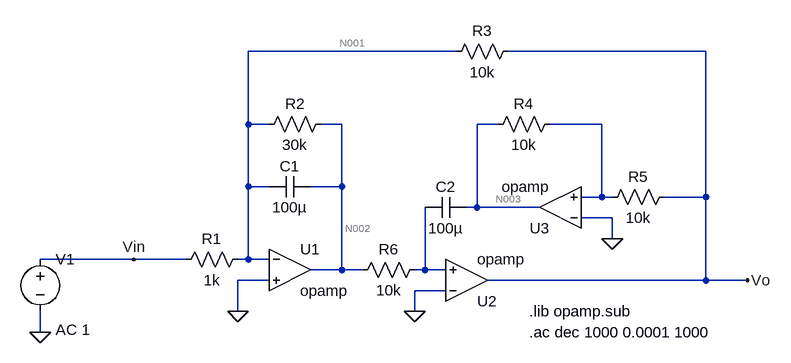
[diagram p0: schematic simulacion.asc]
simulacion.asc, the LTspice schematic file:
Version 4
SHEET 1 880 680
WIRE 288 -112 -32 -112
WIRE 672 -112 368 -112
WIRE -32 0 -32 -112
WIRE 0 0 -32 0
WIRE 112 0 80 0
WIRE 352 0 320 0
WIRE 512 0 432 0
WIRE -32 96 -32 0
WIRE 0 96 -32 96
WIRE 112 96 112 0
WIRE 112 96 64 96
WIRE 512 112 512 0
WIRE 512 112 480 112
WIRE 528 112 512 112
WIRE 672 112 672 -112
WIRE 672 112 608 112
WIRE 320 128 320 0
WIRE 320 128 304 128
WIRE 416 128 320 128
WIRE 528 144 480 144
WIRE 528 176 528 144
WIRE -208 208 -352 208
WIRE -128 208 -208 208
WIRE -32 208 -32 96
WIRE -32 208 -48 208
WIRE 0 208 -32 208
WIRE 112 224 112 96
WIRE 112 224 64 224
WIRE 144 224 112 224
WIRE 240 224 240 128
WIRE 240 224 224 224
WIRE 272 224 240 224
WIRE 0 240 -48 240
WIRE 672 240 672 112
WIRE 672 240 336 240
WIRE 736 240 672 240
WIRE 272 256 224 256
WIRE -48 288 -48 240
WIRE 224 288 224 256
WIRE -352 320 -352 288
FLAG 528 176 0
FLAG 224 288 0
FLAG -48 288 0
FLAG 736 240 Vo
FLAG -208 208 Vin
FLAG -352 320 0
SYMBOL OpAmps\\opamp 32 160 R0
SYMATTR InstName U1
SYMBOL OpAmps\\opamp 304 304 M180
SYMATTR InstName U2
SYMBOL OpAmps\\opamp 448 192 R180
SYMATTR InstName U3
SYMBOL res -32 192 R90
WINDOW 0 0 56 VBottom 2
WINDOW 3 32 56 VTop 2
SYMATTR InstName R1
SYMATTR Value 1k
SYMBOL res 96 -16 R90
WINDOW 0 0 56 VBottom 2
WINDOW 3 32 56 VTop 2
SYMATTR InstName R2
SYMATTR Value 30k
SYMBOL cap 64 80 R90
WINDOW 0 0 32 VBottom 2
WINDOW 3 32 32 VTop 2
SYMATTR InstName C1
SYMATTR Value 100µ
SYMBOL res 384 -128 R90
WINDOW 0 0 56 VBottom 2
WINDOW 3 32 56 VTop 2
SYMATTR InstName R3
SYMATTR Value 10k
SYMBOL res 448 -16 R90
WINDOW 0 0 56 VBottom 2
WINDOW 3 32 56 VTop 2
SYMATTR InstName R4
SYMATTR Value 10k
SYMBOL res 624 96 R90
WINDOW 0 0 56 VBottom 2
WINDOW 3 32 56 VTop 2
SYMATTR InstName R5
SYMATTR Value 10k
SYMBOL cap 304 112 R90
WINDOW 0 0 32 VBottom 2
WINDOW 3 32 32 VTop 2
SYMATTR InstName C2
SYMATTR Value 100µ
SYMBOL res 240 208 R90
WINDOW 0 0 56 VBottom 2
WINDOW 3 32 56 VTop 2
SYMATTR InstName R6
SYMATTR Value 10k
SYMBOL voltage -352 192 R0
WINDOW 123 24 124 Left 2
WINDOW 39 0 0 Left 0
SYMATTR InstName V1
SYMATTR Value ""
SYMATTR Value2 AC 1
TEXT 400 288 Left 2 !.lib opamp.sub
TEXT 400 320 Left 2 !.ac dec 1000 0.0001 1000

The netlist it stands for:
* simulacion.asc
XU1 N001 0 N002 opamp Aol=100K GBW=10Meg  ; pins invin noninvin out
XU2 0 N005 Vo opamp Aol=100K GBW=10Meg  ; pins invin noninvin out
XU3 0 N004 N003 opamp Aol=100K GBW=10Meg  ; pins invin noninvin out
R1 N001 Vin 1k
R2 N002 N001 30k
C1 N002 N001 100µ
R3 Vo N001 10k
R4 N004 N003 10k
R5 Vo N004 10k
C2 N003 N005 100µ
R6 N005 N002 10k
V1 Vin 0 AC 1
.lib opamp.sub
.ac dec 1000 0.0001 1000
.backanno
.end

* Results of the author's LTspice run, read from the files saved beside the schematic
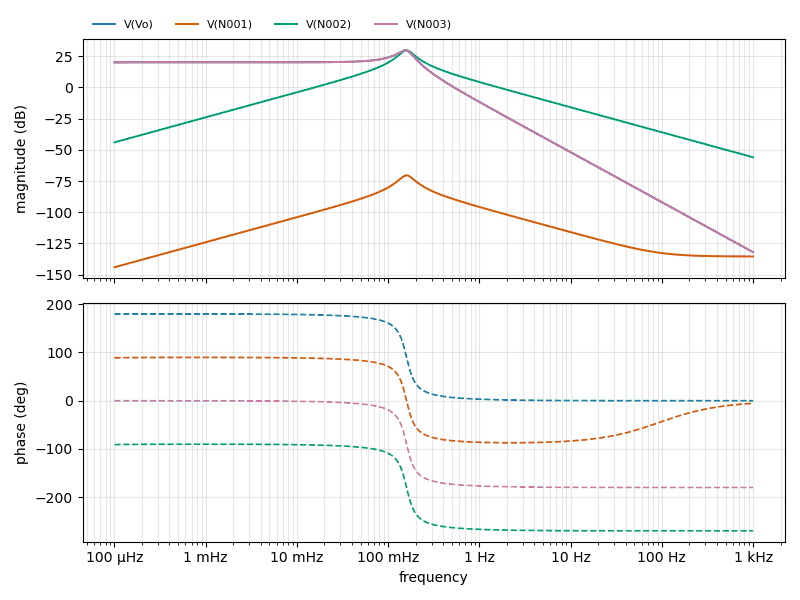
[diagram p1: AC Analysis of simulacion.asc, plotted from the saved traces]
* AC Analysis, 1 run:
*   V(Vo): 20.00 dB at 100 µHz, -131.93 dB at 1 kHz, peak 29.66 dB at 154.5 mHz, 3 dB below the peak at 124.9 mHz and 179.6 mHz
*   V(N001): -144.03 dB at 100 µHz, -135.40 dB at 1 kHz, peak -70.46 dB at 159.2 mHz, 3 dB below the peak at 134.8 mHz and 187.9 mHz
*   V(N002): -44.04 dB at 100 µHz, -55.96 dB at 1 kHz, peak 29.54 dB at 159.2 mHz, 3 dB below the peak at 134.8 mHz and 187.9 mHz
*   V(N003): 20.00 dB at 100 µHz, -131.93 dB at 1 kHz, peak 29.66 dB at 154.5 mHz, 3 dB below the peak at 124.9 mHz and 179.6 mHz